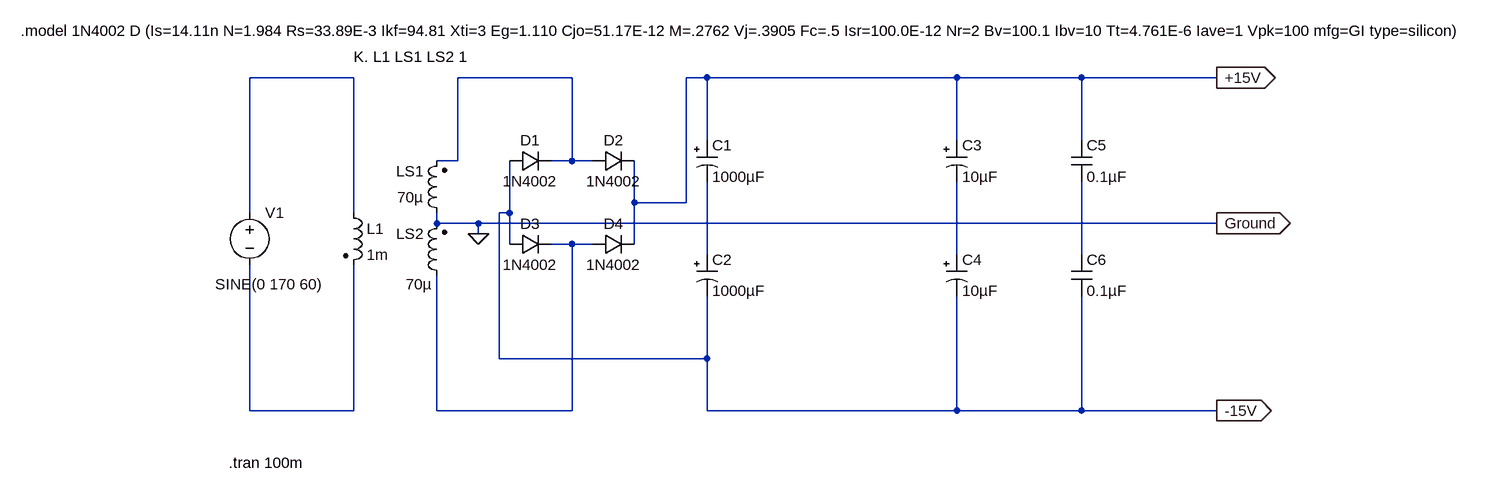
[diagram p0: schematic power_supply.asc]
power_supply.asc, the LTspice schematic file:
Version 4
SHEET 1 2068 680
WIRE 96 -96 -64 -96
WIRE 432 -96 256 -96
WIRE 640 -96 608 -96
WIRE 1024 -96 640 -96
WIRE 1216 -96 1024 -96
WIRE 1424 -96 1216 -96
WIRE 640 0 640 -96
WIRE 1024 0 1024 -96
WIRE 1216 0 1216 -96
WIRE 256 32 256 -96
WIRE 256 32 224 32
WIRE 432 32 432 -96
WIRE 432 32 400 32
WIRE 464 32 432 32
WIRE 528 96 528 32
WIRE 608 96 608 -96
WIRE 608 96 528 96
WIRE -64 112 -64 -96
WIRE 96 112 96 -96
WIRE 336 112 336 32
WIRE 336 112 320 112
WIRE 224 128 224 112
WIRE 288 128 224 128
WIRE 1424 128 288 128
WIRE 288 144 288 128
WIRE 336 160 336 112
WIRE 432 160 400 160
WIRE 464 160 432 160
WIRE 528 160 528 96
WIRE 640 176 640 64
WIRE 1024 176 1024 64
WIRE 1216 176 1216 64
WIRE 320 336 320 112
WIRE 640 336 640 240
WIRE 640 336 320 336
WIRE -64 416 -64 192
WIRE 96 416 96 192
WIRE 96 416 -64 416
WIRE 224 416 224 208
WIRE 432 416 432 160
WIRE 432 416 224 416
WIRE 640 416 640 336
WIRE 1024 416 1024 240
WIRE 1024 416 640 416
WIRE 1216 416 1216 240
WIRE 1216 416 1024 416
WIRE 1424 416 1216 416
FLAG 288 144 0
FLAG 1424 -96 +15V
IOPIN 1424 -96 Out
FLAG 1424 416 -15V
IOPIN 1424 416 Out
FLAG 1424 128 Ground
IOPIN 1424 128 Out
SYMBOL voltage -64 96 R0
WINDOW 123 0 0 Left 0
WINDOW 39 -53 154 Left 2
WINDOW 3 -53 126 Left 2
SYMATTR Value SINE(0 170 60)
SYMATTR InstName V1
SYMBOL ind2 80 96 R0
SYMATTR InstName L1
SYMATTR Type ind
SYMATTR Value 1m
SYMATTR SpiceLine Rser=1
SYMBOL ind2 240 128 R180
WINDOW 0 36 80 Left 2
WINDOW 3 36 40 Left 2
SYMATTR InstName LS1
SYMATTR Value 70µ
SYMATTR Type ind
SYMBOL ind2 240 224 R180
WINDOW 0 36 80 Left 2
WINDOW 3 23 2 Left 2
SYMATTR InstName LS2
SYMATTR Value 70µ
SYMATTR Type ind
SYMBOL diode 336 16 M90
WINDOW 0 0 32 VBottom 2
WINDOW 3 32 32 VTop 2
SYMATTR InstName D1
SYMATTR Value 1N4002
SYMBOL diode 464 16 M90
WINDOW 0 0 32 VBottom 2
WINDOW 3 32 32 VTop 2
SYMATTR InstName D2
SYMATTR Value 1N4002
SYMBOL diode 336 144 M90
WINDOW 0 0 32 VBottom 2
WINDOW 3 32 32 VTop 2
SYMATTR InstName D3
SYMATTR Value 1N4002
SYMBOL diode 464 144 M90
WINDOW 0 0 32 VBottom 2
WINDOW 3 32 32 VTop 2
SYMATTR InstName D4
SYMATTR Value 1N4002
SYMBOL polcap 624 0 R0
SYMATTR InstName C1
SYMATTR Value 1000µF
SYMBOL polcap 624 176 R0
SYMATTR InstName C2
SYMATTR Value 1000µF
SYMBOL polcap 1008 0 R0
SYMATTR InstName C3
SYMATTR Value 10µF
SYMBOL polcap 1008 176 R0
SYMATTR InstName C4
SYMATTR Value 10µF
SYMBOL cap 1200 0 R0
SYMATTR InstName C5
SYMATTR Value 0.1µF
SYMBOL cap 1200 176 R0
SYMATTR InstName C6
SYMATTR Value 0.1µF
TEXT -96 496 Left 2 !.tran 100m
TEXT 96 -128 Left 2 !K. L1 LS1 LS2 1
TEXT -416 -168 Left 2 !.model 1N4002 D (Is=14.11n N=1.984 Rs=33.89E-3 Ikf=94.81 Xti=3 Eg=1.110 Cjo=51.17E-12 M=.2762 Vj=.3905 Fc=.5 Isr=100.0E-12 Nr=2 Bv=100.1 Ibv=10 Tt=4.761E-6 Iave=1 Vpk=100 mfg=GI type=silicon)

The netlist it stands for:
* power_supply.asc
V1 N001 N007 SINE(0 170 60)
L1 N001 N007 1m Rser=1
LS1 0 N002 70µ
LS2 N003 0 70µ
D1 -15V N002 1N4002
D2 N002 +15V 1N4002
D3 -15V N003 1N4002
D4 N003 +15V 1N4002
C1 +15V N004 1000µF
C2 N004 -15V 1000µF
C3 +15V N005 10µF
C4 N005 -15V 10µF
C5 +15V N006 0.1µF
C6 N006 -15V 0.1µF
.model D D
.lib standard.dio
.tran 100m
K. L1 LS1 LS2 1
.model 1N4002 D (Is=14.11n N=1.984 Rs=33.89E-3 Ikf=94.81 Xti=3 Eg=1.110 Cjo=51.17E-12 M=.2762 Vj=.3905 Fc=.5 Isr=100.0E-12 Nr=2 Bv=100.1 Ibv=10 Tt=4.761E-6 Iave=1 Vpk=100 mfg=GI type=silicon)
.backanno
.end